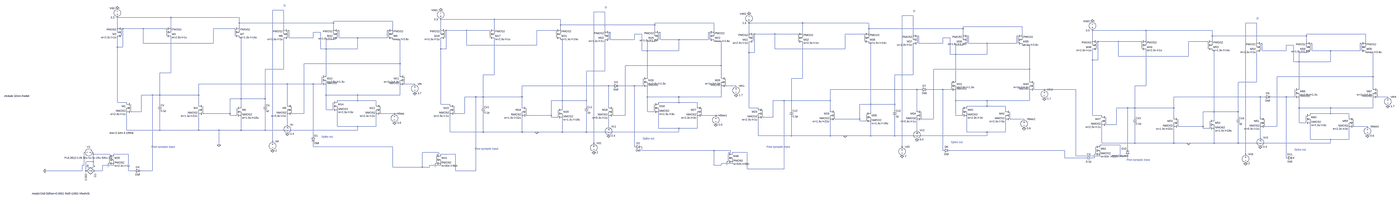
[diagram p0: schematic multineuronarray2.asc, whole sheet]
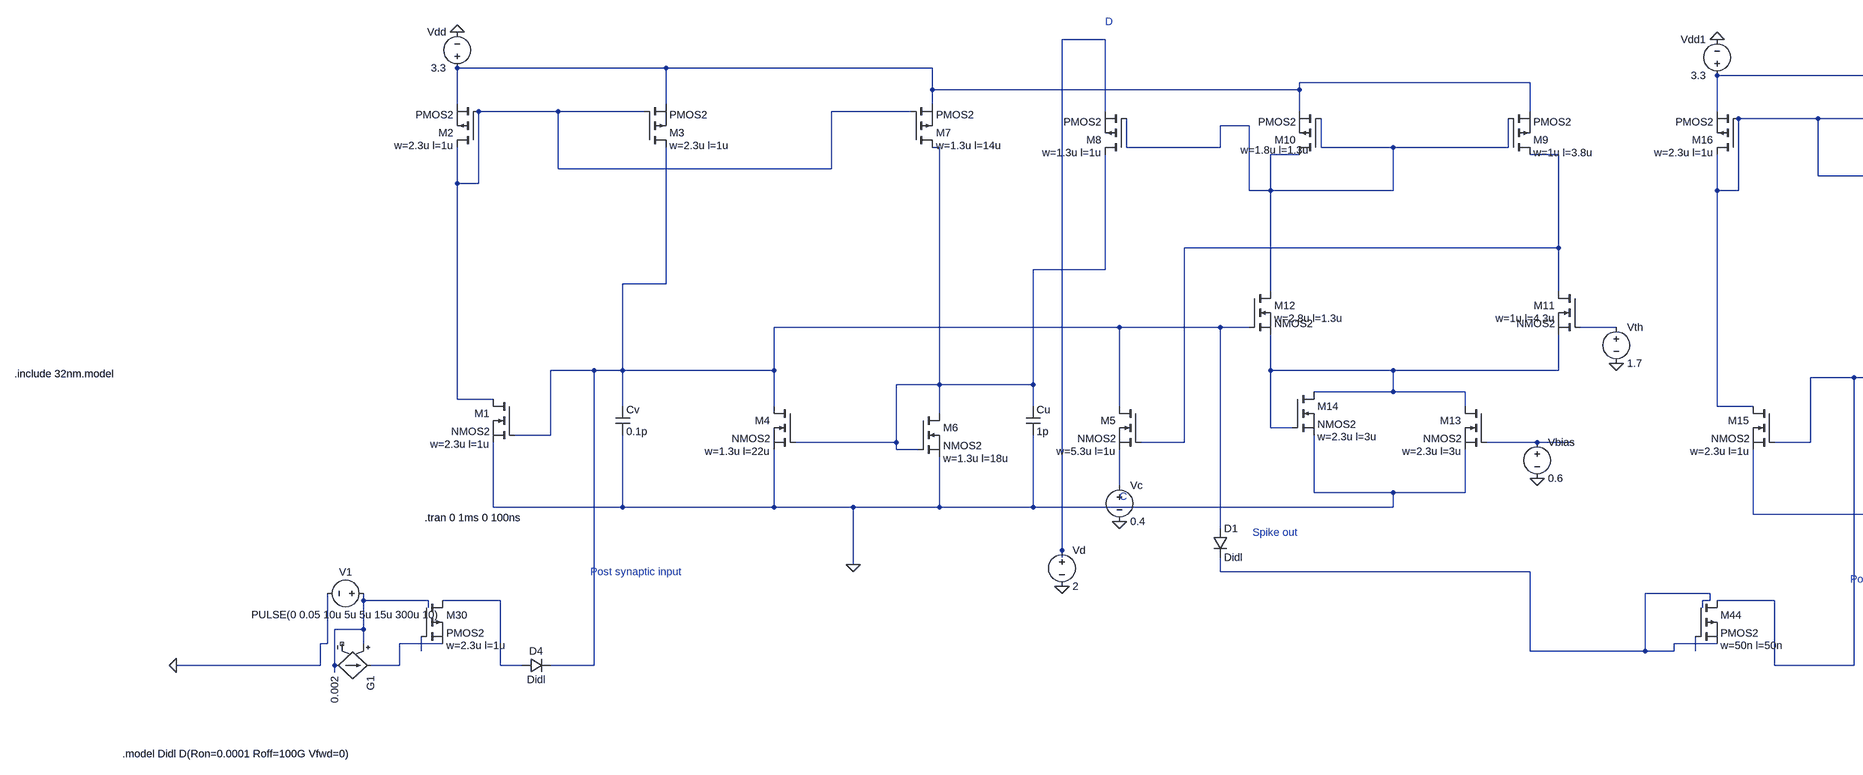
[diagram p1: schematic multineuronarray2.asc, part, row 1 of 1, column 1 of 3]
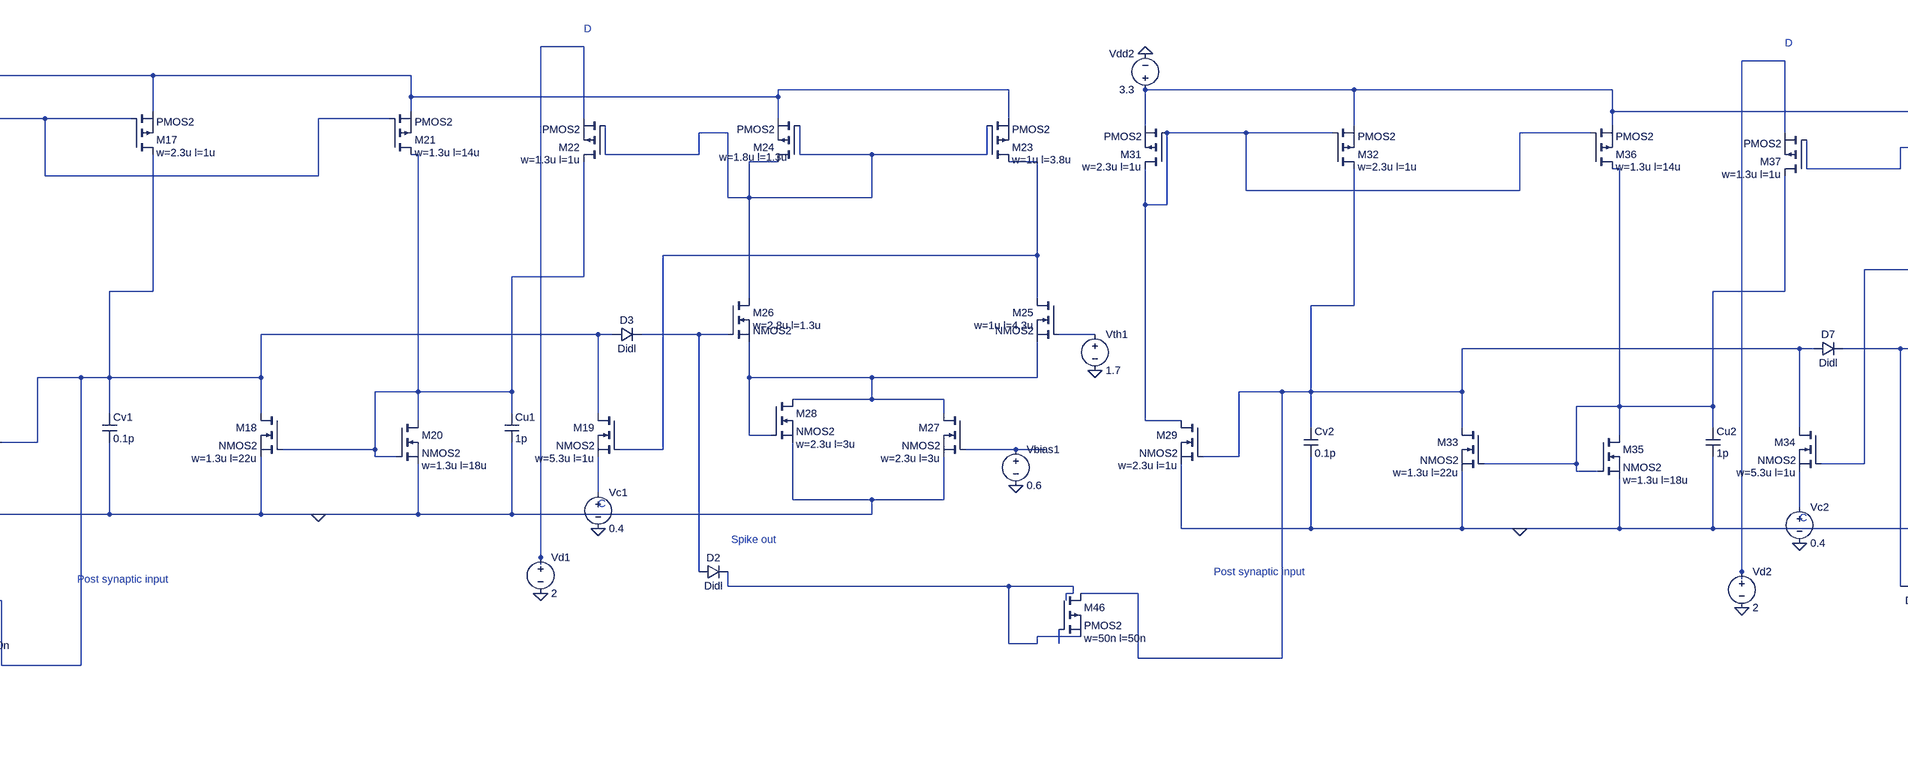
[diagram p2: schematic multineuronarray2.asc, part, row 1 of 1, column 2 of 3]
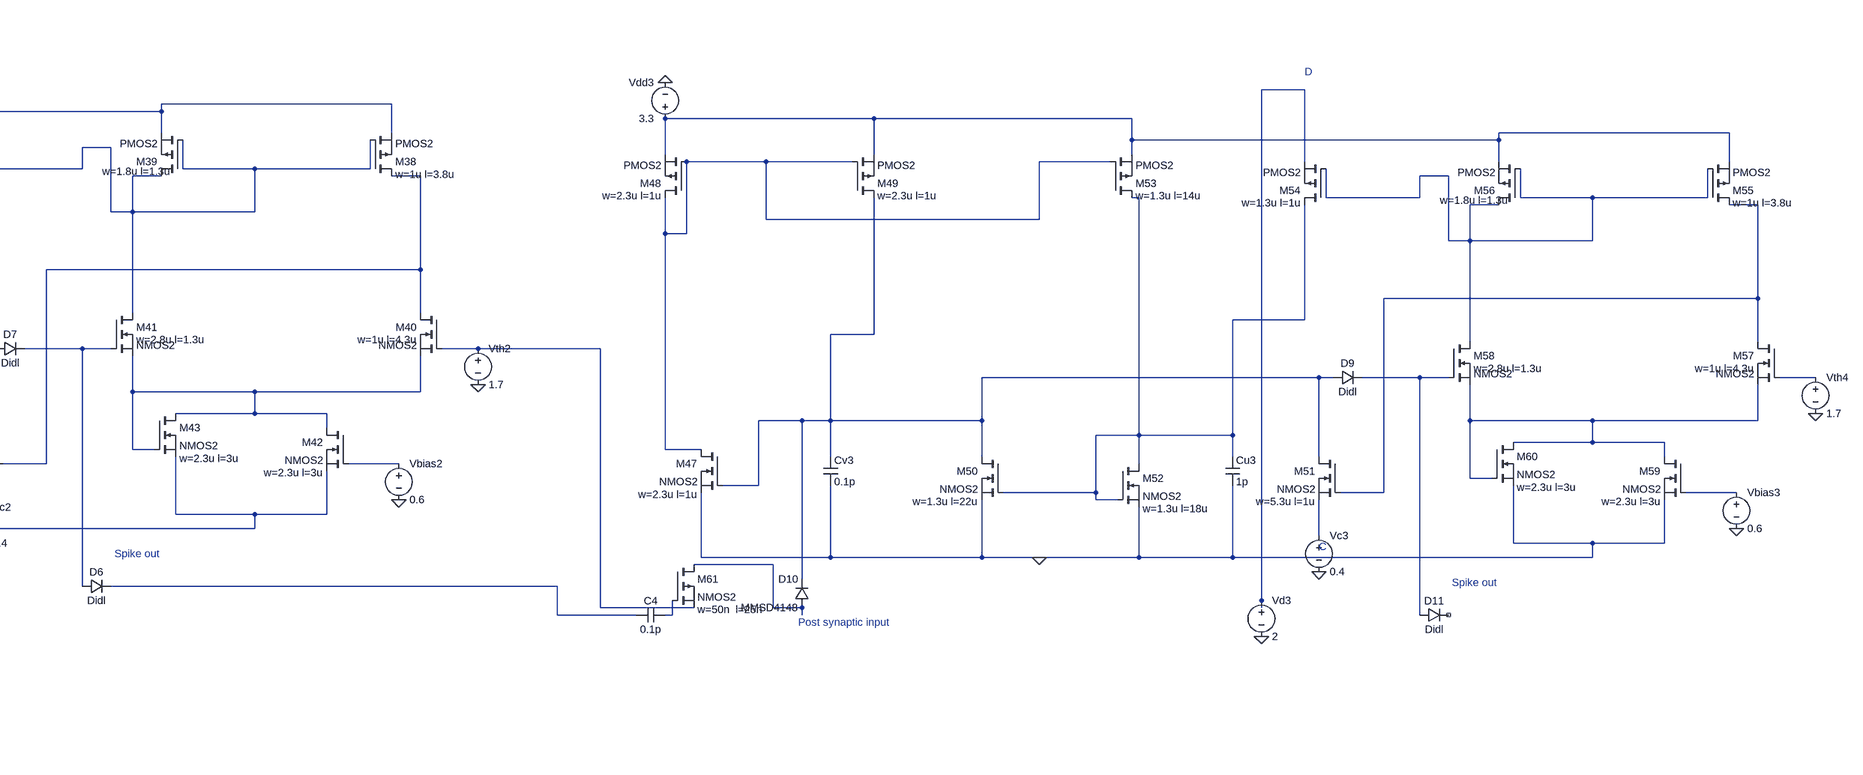
[diagram p3: schematic multineuronarray2.asc, part, row 1 of 1, column 3 of 3]
multineuronarray2.asc, the LTspice schematic file:
Version 4.1
SHEET 1 10912 1240
WIRE 1216 -736 1120 -736
WIRE 4016 -720 3920 -720
WIRE 6704 -688 6608 -688
WIRE 240 -672 -224 -672
WIRE 832 -672 240 -672
WIRE 3040 -656 2576 -656
WIRE 3632 -656 3040 -656
WIRE 2160 -640 1648 -640
WIRE 832 -624 832 -672
WIRE 1648 -624 1648 -640
WIRE 1648 -624 832 -624
WIRE 4960 -624 4448 -624
WIRE 5728 -624 5264 -624
WIRE 6320 -624 5728 -624
WIRE 9696 -624 9600 -624
WIRE 3632 -608 3632 -656
WIRE 4448 -608 4448 -624
WIRE 4448 -608 3632 -608
WIRE -224 -592 -224 -672
WIRE 240 -592 240 -672
WIRE 832 -592 832 -624
WIRE 7648 -592 7136 -592
WIRE 0 -576 -176 -576
WIRE 192 -576 0 -576
WIRE 784 -576 608 -576
WIRE 1216 -576 1216 -736
WIRE 1648 -576 1648 -624
WIRE 2160 -576 2160 -640
WIRE 2576 -576 2576 -656
WIRE 3040 -576 3040 -656
WIRE 3632 -576 3632 -608
WIRE 6320 -576 6320 -624
WIRE 7136 -576 7136 -592
WIRE 7136 -576 6320 -576
WIRE 2800 -560 2624 -560
WIRE 2992 -560 2800 -560
WIRE 3584 -560 3408 -560
WIRE 4016 -560 4016 -720
WIRE 4448 -560 4448 -608
WIRE 4960 -560 4960 -624
WIRE 8720 -560 8256 -560
WIRE 9312 -560 8720 -560
WIRE 1536 -544 1472 -544
WIRE 5264 -544 5264 -624
WIRE 5728 -544 5728 -624
WIRE 6320 -544 6320 -576
WIRE 4336 -528 4272 -528
WIRE 5488 -528 5312 -528
WIRE 5680 -528 5488 -528
WIRE 6272 -528 6096 -528
WIRE 6704 -528 6704 -688
WIRE 7136 -528 7136 -576
WIRE 7648 -528 7648 -592
WIRE 10640 -528 10128 -528
WIRE 9312 -512 9312 -560
WIRE 10128 -512 10128 -528
WIRE 10128 -512 9312 -512
WIRE 848 -496 832 -496
WIRE 1264 -496 1264 -560
WIRE 1472 -496 1472 -544
WIRE 1472 -496 1264 -496
WIRE 1696 -496 1696 -560
WIRE 1856 -496 1696 -496
WIRE 2112 -496 2112 -560
WIRE 2112 -496 1856 -496
WIRE 7024 -496 6960 -496
WIRE 1648 -480 1584 -480
WIRE 2224 -480 2160 -480
WIRE 3648 -480 3632 -480
WIRE 4064 -480 4064 -544
WIRE 4272 -480 4272 -528
WIRE 4272 -480 4064 -480
WIRE 4496 -480 4496 -544
WIRE 4656 -480 4496 -480
WIRE 4912 -480 4912 -544
WIRE 4912 -480 4656 -480
WIRE 8256 -480 8256 -560
WIRE 8720 -480 8720 -560
WIRE 9312 -480 9312 -512
WIRE 4448 -464 4384 -464
WIRE 5024 -464 4960 -464
WIRE 8480 -464 8304 -464
WIRE 8672 -464 8480 -464
WIRE 9264 -464 9088 -464
WIRE 9696 -464 9696 -624
WIRE 10128 -464 10128 -512
WIRE 10640 -464 10640 -528
WIRE 0 -448 0 -576
WIRE 608 -448 608 -576
WIRE 608 -448 0 -448
WIRE 6336 -448 6320 -448
WIRE 6752 -448 6752 -512
WIRE 6960 -448 6960 -496
WIRE 6960 -448 6752 -448
WIRE 7184 -448 7184 -512
WIRE 7344 -448 7184 -448
WIRE 7600 -448 7600 -512
WIRE 7600 -448 7344 -448
WIRE 2800 -432 2800 -560
WIRE 3408 -432 3408 -560
WIRE 3408 -432 2800 -432
WIRE 7136 -432 7072 -432
WIRE 7712 -432 7648 -432
WIRE 10016 -432 9952 -432
WIRE -224 -416 -224 -496
WIRE -176 -416 -176 -576
WIRE -176 -416 -224 -416
WIRE 1536 -400 1536 -544
WIRE 1584 -400 1584 -480
WIRE 1584 -400 1536 -400
WIRE 1856 -400 1856 -496
WIRE 1856 -400 1584 -400
WIRE 2576 -400 2576 -480
WIRE 2624 -400 2624 -560
WIRE 2624 -400 2576 -400
WIRE 5488 -400 5488 -528
WIRE 6096 -400 6096 -528
WIRE 6096 -400 5488 -400
WIRE 4336 -384 4336 -528
WIRE 4384 -384 4384 -464
WIRE 4384 -384 4336 -384
WIRE 4656 -384 4656 -480
WIRE 4656 -384 4384 -384
WIRE 9328 -384 9312 -384
WIRE 9744 -384 9744 -448
WIRE 9952 -384 9952 -432
WIRE 9952 -384 9744 -384
WIRE 10176 -384 10176 -448
WIRE 10336 -384 10176 -384
WIRE 10592 -384 10592 -448
WIRE 10592 -384 10336 -384
WIRE 5264 -368 5264 -448
WIRE 5312 -368 5312 -528
WIRE 5312 -368 5264 -368
WIRE 10128 -368 10064 -368
WIRE 10704 -368 10640 -368
WIRE 7024 -352 7024 -496
WIRE 7072 -352 7072 -432
WIRE 7072 -352 7024 -352
WIRE 7344 -352 7344 -448
WIRE 7344 -352 7072 -352
WIRE 8480 -336 8480 -464
WIRE 9088 -336 9088 -464
WIRE 9088 -336 8480 -336
WIRE 8256 -304 8256 -384
WIRE 8304 -304 8304 -464
WIRE 8304 -304 8256 -304
WIRE 10016 -288 10016 -432
WIRE 10064 -288 10064 -368
WIRE 10064 -288 10016 -288
WIRE 10336 -288 10336 -384
WIRE 10336 -288 10064 -288
WIRE 2224 -272 2224 -480
WIRE 2224 -272 1392 -272
WIRE 5024 -256 5024 -464
WIRE 5024 -256 4192 -256
WIRE 1216 -224 1216 -480
WIRE 1216 -224 1056 -224
WIRE 7712 -224 7712 -432
WIRE 7712 -224 6880 -224
WIRE 4016 -208 4016 -464
WIRE 4016 -208 3856 -208
WIRE 240 -192 240 -496
WIRE 240 -192 144 -192
WIRE 1584 -176 1584 -400
WIRE 2224 -176 2224 -272
WIRE 3040 -176 3040 -480
WIRE 3040 -176 2944 -176
WIRE 6704 -176 6704 -432
WIRE 6704 -176 6544 -176
WIRE 4384 -160 4384 -384
WIRE 5024 -160 5024 -256
WIRE 10704 -160 10704 -368
WIRE 10704 -160 9872 -160
WIRE 5728 -144 5728 -448
WIRE 5728 -144 5632 -144
WIRE 7072 -128 7072 -352
WIRE 7712 -128 7712 -224
WIRE 9696 -112 9696 -368
WIRE 9696 -112 9536 -112
WIRE 1248 -96 480 -96
WIRE 1472 -96 1248 -96
WIRE 1536 -96 1472 -96
WIRE 2352 -96 2272 -96
WIRE 4048 -80 3280 -80
WIRE 4080 -80 4048 -80
WIRE 4272 -80 4144 -80
WIRE 4336 -80 4272 -80
WIRE 5152 -80 5072 -80
WIRE 8720 -80 8720 -384
WIRE 8720 -80 8624 -80
WIRE 10064 -64 10064 -288
WIRE 10704 -64 10704 -160
WIRE 6736 -48 5968 -48
WIRE 6768 -48 6736 -48
WIRE 6960 -48 6832 -48
WIRE 7024 -48 6960 -48
WIRE 7840 -48 7760 -48
WIRE 8112 -48 7840 -48
WIRE 80 0 -16 0
WIRE 144 0 144 -192
WIRE 144 0 80 0
WIRE 480 0 480 -96
WIRE 480 0 144 0
WIRE 1584 0 1584 -80
WIRE 1856 0 1584 0
WIRE 2224 0 2224 -80
WIRE 2224 0 1856 0
WIRE 2880 16 2784 16
WIRE 2944 16 2944 -176
WIRE 2944 16 2880 16
WIRE 3280 16 3280 -80
WIRE 3280 16 2944 16
WIRE 4384 16 4384 -64
WIRE 4656 16 4384 16
WIRE 5024 16 5024 -64
WIRE 5024 16 4656 16
WIRE 9728 16 8960 16
WIRE 9760 16 9728 16
WIRE 9952 16 9824 16
WIRE 10016 16 9952 16
WIRE 10832 16 10752 16
WIRE 848 32 848 -496
WIRE 848 32 752 32
WIRE 1056 32 1056 -224
WIRE 1056 32 848 32
WIRE 1856 48 1856 0
WIRE 1856 48 1680 48
WIRE 2016 48 1856 48
WIRE 3648 48 3648 -480
WIRE 3648 48 3552 48
WIRE 3856 48 3856 -208
WIRE 3856 48 3648 48
WIRE 5568 48 5472 48
WIRE 5632 48 5632 -144
WIRE 5632 48 5568 48
WIRE 5968 48 5968 -48
WIRE 5968 48 5632 48
WIRE 7072 48 7072 -32
WIRE 7344 48 7072 48
WIRE 7712 48 7712 -32
WIRE 7712 48 7344 48
WIRE -224 64 -224 -416
WIRE -144 64 -224 64
WIRE 4656 64 4656 16
WIRE 4656 64 4480 64
WIRE 4816 64 4656 64
WIRE 144 80 144 0
WIRE 480 80 480 0
WIRE 1056 80 1056 32
WIRE 1248 80 1248 -96
WIRE 2016 80 2016 48
WIRE 2576 80 2576 -400
WIRE 2656 80 2576 80
WIRE 6336 80 6336 -448
WIRE 6336 80 6240 80
WIRE 6544 80 6544 -176
WIRE 6544 80 6336 80
WIRE 848 96 848 32
WIRE 2944 96 2944 16
WIRE 3280 96 3280 16
WIRE 3856 96 3856 48
WIRE 4048 96 4048 -80
WIRE 4816 96 4816 64
WIRE 7344 96 7344 48
WIRE 7344 96 7168 96
WIRE 7504 96 7344 96
WIRE 3648 112 3648 48
WIRE 5264 112 5264 -368
WIRE 5344 112 5264 112
WIRE 8560 112 8464 112
WIRE 8624 112 8624 -80
WIRE 8624 112 8560 112
WIRE 8960 112 8960 16
WIRE 8960 112 8624 112
WIRE 10064 112 10064 32
WIRE 10336 112 10064 112
WIRE 10704 112 10704 32
WIRE 10704 112 10336 112
WIRE 1584 128 1584 0
WIRE 1632 128 1584 128
WIRE 5632 128 5632 48
WIRE 5968 128 5968 48
WIRE 6544 128 6544 80
WIRE 6736 128 6736 -48
WIRE 7504 128 7504 96
WIRE -16 144 -16 0
WIRE -16 144 -96 144
WIRE 4384 144 4384 16
WIRE 4432 144 4384 144
WIRE 6336 144 6336 80
WIRE 9328 144 9328 -384
WIRE 9328 144 9232 144
WIRE 9536 144 9536 -112
WIRE 9536 144 9328 144
WIRE 752 160 752 32
WIRE 752 160 528 160
WIRE 1392 160 1392 -272
WIRE 1392 160 1296 160
WIRE 2176 160 2064 160
WIRE 2256 160 2176 160
WIRE 2784 160 2784 16
WIRE 2784 160 2704 160
WIRE 10336 160 10336 112
WIRE 10336 160 10160 160
WIRE 10496 160 10336 160
WIRE 752 176 752 160
WIRE 800 176 752 176
WIRE 3552 176 3552 48
WIRE 3552 176 3328 176
WIRE 4192 176 4192 -256
WIRE 4192 176 4096 176
WIRE 4976 176 4864 176
WIRE 5040 176 4976 176
WIRE 7072 176 7072 48
WIRE 7120 176 7072 176
WIRE 8256 176 8256 -304
WIRE 8336 176 8256 176
WIRE 3552 192 3552 176
WIRE 3600 192 3552 192
WIRE 5472 192 5472 48
WIRE 5472 192 5392 192
WIRE 8624 192 8624 112
WIRE 8960 192 8960 112
WIRE 9536 192 9536 144
WIRE 9728 192 9728 16
WIRE 10496 192 10496 160
WIRE 6240 208 6240 80
WIRE 6240 208 6016 208
WIRE 6880 208 6880 -224
WIRE 6880 208 6784 208
WIRE 7664 208 7552 208
WIRE 9328 208 9328 144
WIRE 6240 224 6240 208
WIRE 6288 224 6240 224
WIRE 10064 240 10064 112
WIRE 10112 240 10064 240
WIRE 1248 256 1248 176
WIRE 8464 256 8464 112
WIRE 8464 256 8384 256
WIRE 1680 272 1680 144
WIRE 1856 272 1680 272
WIRE 2016 272 2016 176
WIRE 2016 272 1856 272
WIRE 4048 272 4048 192
WIRE 9232 272 9232 144
WIRE 9232 272 9008 272
WIRE 9872 272 9872 -160
WIRE 9872 272 9776 272
WIRE 10656 272 10544 272
WIRE 4480 288 4480 160
WIRE 4656 288 4480 288
WIRE 4816 288 4816 192
WIRE 4816 288 4656 288
WIRE 9232 288 9232 272
WIRE 9280 288 9232 288
WIRE -144 304 -144 160
WIRE 144 304 144 144
WIRE 144 304 -144 304
WIRE 480 304 480 176
WIRE 480 304 144 304
WIRE 656 304 480 304
WIRE 848 304 848 192
WIRE 848 304 656 304
WIRE 1056 304 1056 144
WIRE 1056 304 848 304
WIRE 1856 304 1856 272
WIRE 1856 304 1056 304
WIRE 6736 304 6736 224
WIRE 2656 320 2656 176
WIRE 2944 320 2944 160
WIRE 2944 320 2656 320
WIRE 3280 320 3280 192
WIRE 3280 320 2944 320
WIRE 3408 320 3280 320
WIRE 3648 320 3648 208
WIRE 3648 320 3408 320
WIRE 3856 320 3856 160
WIRE 3856 320 3648 320
WIRE 4656 320 4656 288
WIRE 4656 320 3856 320
WIRE 7168 320 7168 192
WIRE 7344 320 7168 320
WIRE 7504 320 7504 224
WIRE 7504 320 7344 320
WIRE 1472 352 1472 -96
WIRE 5344 352 5344 208
WIRE 5632 352 5632 192
WIRE 5632 352 5344 352
WIRE 5968 352 5968 224
WIRE 5968 352 5632 352
WIRE 6096 352 5968 352
WIRE 6336 352 6336 240
WIRE 6336 352 6096 352
WIRE 6544 352 6544 192
WIRE 6544 352 6336 352
WIRE 7344 352 7344 320
WIRE 7344 352 6544 352
WIRE 9728 368 9728 288
WIRE 10160 384 10160 256
WIRE 10336 384 10160 384
WIRE 10496 384 10496 288
WIRE 10496 384 10336 384
WIRE 1120 400 1120 -736
WIRE 1120 416 1120 400
WIRE 3920 416 3920 -720
WIRE 8336 416 8336 272
WIRE 8624 416 8624 256
WIRE 8624 416 8336 416
WIRE 8960 416 8960 288
WIRE 8960 416 8624 416
WIRE 9088 416 8960 416
WIRE 9328 416 9328 304
WIRE 9328 416 9088 416
WIRE 9536 416 9536 256
WIRE 9536 416 9328 416
WIRE 10336 416 10336 384
WIRE 10336 416 9536 416
WIRE 656 432 656 304
WIRE 3920 432 3920 416
WIRE 8496 432 8320 432
WIRE 1472 448 1472 416
WIRE 2160 448 1472 448
WIRE 4272 448 4272 -80
WIRE 6608 448 6608 -688
WIRE 6608 464 6608 448
WIRE 8560 464 8560 112
WIRE 4336 480 4336 448
WIRE 4960 480 4336 480
WIRE 5104 480 4960 480
WIRE 6960 480 6960 -48
WIRE 8016 480 7024 480
WIRE 2560 496 2416 496
WIRE 5104 496 5104 480
WIRE 5104 496 5088 496
WIRE 5248 496 5120 496
WIRE -432 512 -432 496
WIRE -288 512 -432 512
WIRE -128 512 -256 512
WIRE 2560 512 2560 496
WIRE 2560 512 2544 512
WIRE 2704 512 2576 512
WIRE 5088 512 5088 496
WIRE 9600 512 9600 -624
WIRE -288 528 -288 512
WIRE 2544 528 2544 512
WIRE 8112 528 8112 -48
WIRE 8320 528 8112 528
WIRE 8496 528 8496 432
WIRE 8560 528 8496 528
WIRE 9600 528 9600 512
WIRE 8016 544 8016 480
WIRE 8192 544 8016 544
WIRE 8272 544 8272 512
WIRE 8272 544 8256 544
WIRE 8560 544 8560 528
WIRE 9952 544 9952 16
WIRE -432 576 -432 512
WIRE -432 576 -496 576
WIRE 5120 592 5024 592
WIRE -512 608 -512 496
WIRE -512 608 -528 608
WIRE -432 608 -432 576
WIRE -256 608 -352 608
WIRE 2576 608 2480 608
WIRE 4960 608 4960 480
WIRE 5024 608 5024 592
WIRE 5024 608 4960 608
WIRE 5072 608 5072 576
WIRE -304 624 -304 592
WIRE 2160 624 2160 448
WIRE 2416 624 2416 496
WIRE 2416 624 2160 624
WIRE 2480 624 2480 608
WIRE 2480 624 2416 624
WIRE 2528 624 2528 592
WIRE 5248 640 5248 496
WIRE 5568 640 5568 48
WIRE 5568 640 5248 640
WIRE -528 656 -528 608
WIRE -528 656 -848 656
WIRE -496 656 -496 576
WIRE -352 656 -352 608
WIRE -352 656 -416 656
WIRE -128 656 -128 512
WIRE -80 656 -128 656
WIRE 80 656 80 0
WIRE 80 656 -16 656
WIRE 2704 656 2704 512
WIRE 2880 656 2880 16
WIRE 2880 656 2704 656
WIRE -496 672 -496 656
FLAG -224 -752 0
FLAG 2176 240 0
FLAG 2352 -16 0
FLAG 1120 480 0
FLAG 1248 336 0
FLAG 656 432 0
FLAG -848 656 0
FLAG 2576 -736 0
FLAG 4976 256 0
FLAG 5152 0 0
FLAG 3920 496 0
FLAG 4048 352 0
FLAG 3408 320 0
FLAG 5264 -704 0
FLAG 7664 288 0
FLAG 7840 32 0
FLAG 6608 528 0
FLAG 6736 384 0
FLAG 6096 352 0
FLAG 8256 -640 0
FLAG 10656 352 0
FLAG 10832 96 0
FLAG 9600 592 0
FLAG 9728 448 0
FLAG 9088 416 0
DATAFLAG 848 -144 ""
DATAFLAG 3648 -128 ""
DATAFLAG 6336 -96 ""
DATAFLAG 9328 -32 ""
SYMBOL nmos -96 64 M0
WINDOW 123 56 100 Left 2
SYMATTR Value2 w=2.3u l=1u
SYMATTR InstName M1
SYMATTR Value NMOS2
SYMBOL pmos -176 -496 R180
WINDOW 123 56 4 Left 2
SYMATTR Value2 w=2.3u l=1u
SYMATTR InstName M2
SYMATTR Value PMOS2
SYMBOL pmos 192 -496 M180
WINDOW 123 56 4 Left 2
SYMATTR Value2 w=2.3u l=1u
SYMATTR InstName M3
SYMATTR Value PMOS2
SYMBOL nmos 528 80 M0
WINDOW 123 56 100 Left 2
SYMATTR Value2 w=1.3u l=22u
SYMATTR InstName M4
SYMATTR Value NMOS2
SYMBOL nmos 1296 80 M0
WINDOW 123 56 100 Left 2
SYMATTR Value2 w=5.3u l=1u
SYMATTR InstName M5
SYMATTR Value NMOS2
SYMBOL nmos 800 96 R0
WINDOW 123 56 100 Left 2
SYMATTR Value2 w=1.3u l=18u
SYMATTR InstName M6
SYMATTR Value NMOS2
SYMBOL pmos 784 -496 M180
WINDOW 123 56 4 Left 2
SYMATTR Value2 w=1.3u l=14u
SYMATTR InstName M7
SYMATTR Value PMOS2
SYMBOL pmos 1264 -480 R180
WINDOW 123 56 4 Left 2
SYMATTR Value2 w=1.3u l=1u
SYMATTR InstName M8
SYMATTR Value PMOS2
SYMBOL pmos 2112 -480 M180
WINDOW 123 56 4 Left 2
SYMATTR Value2 w=1u l=3.8u
SYMATTR InstName M9
SYMATTR Value PMOS2
SYMBOL pmos 1696 -480 R180
WINDOW 123 27 10 Left 2
SYMATTR Value2 w=1.8u l=1.3u
SYMATTR InstName M10
SYMATTR Value PMOS2
SYMBOL nmos 2272 -176 M0
WINDOW 123 56 60 Left 2
SYMATTR Value2 w=1u l=4.3u
SYMATTR InstName M11
SYMATTR Value NMOS2
SYMBOL nmos 1536 -176 R0
WINDOW 123 56 60 Left 2
SYMATTR Value2 w=2.8u l=1.3u
SYMATTR InstName M12
SYMATTR Value NMOS2
SYMBOL nmos 2064 80 M0
WINDOW 123 56 100 Left 2
SYMATTR Value2 w=2.3u l=3u
SYMATTR InstName M13
SYMATTR Value NMOS2
SYMBOL nmos 1632 48 R0
WINDOW 123 56 100 Left 2
SYMATTR Value2 w=2.3u l=3u
SYMATTR InstName M14
SYMATTR Value NMOS2
SYMBOL cap 1040 80 R0
SYMATTR InstName Cu
SYMATTR Value 1p
SYMBOL cap 128 80 R0
SYMATTR InstName Cv
SYMATTR Value 0.1p
SYMBOL voltage -224 -656 R180
WINDOW 0 24 96 Left 2
WINDOW 3 24 16 Left 2
WINDOW 123 0 0 Left 0
WINDOW 39 0 0 Left 0
SYMATTR InstName Vdd
SYMATTR Value 3.3
SYMBOL voltage 2352 -112 R0
WINDOW 123 0 0 Left 0
WINDOW 39 0 0 Left 0
SYMATTR InstName Vth
SYMATTR Value 1.7
SYMBOL voltage 2176 144 R0
WINDOW 123 0 0 Left 0
WINDOW 39 0 0 Left 0
SYMATTR InstName Vbias
SYMATTR Value 0.6
SYMBOL voltage 1120 384 R0
SYMATTR InstName Vd
SYMATTR Value 2
SYMBOL voltage 1248 240 R0
SYMATTR InstName Vc
SYMATTR Value 0.4
SYMBOL nmos 2704 80 M0
WINDOW 123 56 100 Left 2
SYMATTR Value2 w=2.3u l=1u
SYMATTR InstName M15
SYMATTR Value NMOS2
SYMBOL pmos 2624 -480 R180
WINDOW 123 56 4 Left 2
SYMATTR Value2 w=2.3u l=1u
SYMATTR InstName M16
SYMATTR Value PMOS2
SYMBOL pmos 2992 -480 M180
WINDOW 123 56 4 Left 2
SYMATTR Value2 w=2.3u l=1u
SYMATTR InstName M17
SYMATTR Value PMOS2
SYMBOL nmos 3328 96 M0
WINDOW 123 56 100 Left 2
SYMATTR Value2 w=1.3u l=22u
SYMATTR InstName M18
SYMATTR Value NMOS2
SYMBOL nmos 4096 96 M0
WINDOW 123 56 100 Left 2
SYMATTR Value2 w=5.3u l=1u
SYMATTR InstName M19
SYMATTR Value NMOS2
SYMBOL nmos 3600 112 R0
WINDOW 123 56 100 Left 2
SYMATTR Value2 w=1.3u l=18u
SYMATTR InstName M20
SYMATTR Value NMOS2
SYMBOL pmos 3584 -480 M180
WINDOW 123 56 4 Left 2
SYMATTR Value2 w=1.3u l=14u
SYMATTR InstName M21
SYMATTR Value PMOS2
SYMBOL pmos 4064 -464 R180
WINDOW 123 56 4 Left 2
SYMATTR Value2 w=1.3u l=1u
SYMATTR InstName M22
SYMATTR Value PMOS2
SYMBOL pmos 4912 -464 M180
WINDOW 123 56 4 Left 2
SYMATTR Value2 w=1u l=3.8u
SYMATTR InstName M23
SYMATTR Value PMOS2
SYMBOL pmos 4496 -464 R180
WINDOW 123 27 10 Left 2
SYMATTR Value2 w=1.8u l=1.3u
SYMATTR InstName M24
SYMATTR Value PMOS2
SYMBOL nmos 5072 -160 M0
WINDOW 123 56 60 Left 2
SYMATTR Value2 w=1u l=4.3u
SYMATTR InstName M25
SYMATTR Value NMOS2
SYMBOL nmos 4336 -160 R0
WINDOW 123 56 60 Left 2
SYMATTR Value2 w=2.8u l=1.3u
SYMATTR InstName M26
SYMATTR Value NMOS2
SYMBOL nmos 4864 96 M0
WINDOW 123 56 100 Left 2
SYMATTR Value2 w=2.3u l=3u
SYMATTR InstName M27
SYMATTR Value NMOS2
SYMBOL nmos 4432 64 R0
WINDOW 123 56 100 Left 2
SYMATTR Value2 w=2.3u l=3u
SYMATTR InstName M28
SYMATTR Value NMOS2
SYMBOL cap 3840 96 R0
SYMATTR InstName Cu1
SYMATTR Value 1p
SYMBOL cap 2928 96 R0
SYMATTR InstName Cv1
SYMATTR Value 0.1p
SYMBOL voltage 2576 -640 R180
WINDOW 0 24 96 Left 2
WINDOW 3 24 16 Left 2
WINDOW 123 0 0 Left 0
WINDOW 39 0 0 Left 0
SYMATTR InstName Vdd1
SYMATTR Value 3.3
SYMBOL voltage 5152 -96 R0
WINDOW 123 0 0 Left 0
WINDOW 39 0 0 Left 0
SYMATTR InstName Vth1
SYMATTR Value 1.7
SYMBOL voltage 4976 160 R0
WINDOW 123 0 0 Left 0
WINDOW 39 0 0 Left 0
SYMATTR InstName Vbias1
SYMATTR Value 0.6
SYMBOL voltage 3920 400 R0
SYMATTR InstName Vd1
SYMATTR Value 2
SYMBOL voltage 4048 256 R0
SYMATTR InstName Vc1
SYMATTR Value 0.4
SYMBOL diode 4080 -64 R270
WINDOW 0 32 32 VTop 2
WINDOW 3 0 32 VBottom 2
SYMATTR InstName D3
SYMATTR Value Didl
SYMBOL g -400 656 R90
SYMATTR InstName G1
SYMATTR Value 0.002
SYMBOL voltage -416 496 R90
WINDOW 0 -32 56 VBottom 2
WINDOW 3 32 56 VTop 2
WINDOW 123 0 0 Left 0
WINDOW 39 0 0 Left 0
SYMATTR InstName V1
SYMATTR Value PULSE(0 0.05 10u 5u 5u 15u 300u 10)
SYMBOL diode -80 672 R270
WINDOW 0 32 32 VTop 2
WINDOW 3 0 32 VBottom 2
SYMATTR InstName D4
SYMATTR Value Didl
SYMBOL pmos -304 512 R0
WINDOW 123 56 100 Left 2
SYMATTR Value2 w=2.3u l=1u
SYMATTR InstName M30
SYMATTR Value PMOS2
SYMBOL nmos 5392 112 M0
WINDOW 123 56 100 Left 2
SYMATTR Value2 w=2.3u l=1u
SYMATTR InstName M29
SYMATTR Value NMOS2
SYMBOL pmos 5312 -448 R180
WINDOW 123 56 4 Left 2
SYMATTR Value2 w=2.3u l=1u
SYMATTR InstName M31
SYMATTR Value PMOS2
SYMBOL pmos 5680 -448 M180
WINDOW 123 56 4 Left 2
SYMATTR Value2 w=2.3u l=1u
SYMATTR InstName M32
SYMATTR Value PMOS2
SYMBOL nmos 6016 128 M0
WINDOW 123 56 100 Left 2
SYMATTR Value2 w=1.3u l=22u
SYMATTR InstName M33
SYMATTR Value NMOS2
SYMBOL nmos 6784 128 M0
WINDOW 123 56 100 Left 2
SYMATTR Value2 w=5.3u l=1u
SYMATTR InstName M34
SYMATTR Value NMOS2
SYMBOL nmos 6288 144 R0
WINDOW 123 56 100 Left 2
SYMATTR Value2 w=1.3u l=18u
SYMATTR InstName M35
SYMATTR Value NMOS2
SYMBOL pmos 6272 -448 M180
WINDOW 123 56 4 Left 2
SYMATTR Value2 w=1.3u l=14u
SYMATTR InstName M36
SYMATTR Value PMOS2
SYMBOL pmos 6752 -432 R180
WINDOW 123 56 4 Left 2
SYMATTR Value2 w=1.3u l=1u
SYMATTR InstName M37
SYMATTR Value PMOS2
SYMBOL pmos 7600 -432 M180
WINDOW 123 56 4 Left 2
SYMATTR Value2 w=1u l=3.8u
SYMATTR InstName M38
SYMATTR Value PMOS2
SYMBOL pmos 7184 -432 R180
WINDOW 123 27 10 Left 2
SYMATTR Value2 w=1.8u l=1.3u
SYMATTR InstName M39
SYMATTR Value PMOS2
SYMBOL nmos 7760 -128 M0
WINDOW 123 56 60 Left 2
SYMATTR Value2 w=1u l=4.3u
SYMATTR InstName M40
SYMATTR Value NMOS2
SYMBOL nmos 7024 -128 R0
WINDOW 123 56 60 Left 2
SYMATTR Value2 w=2.8u l=1.3u
SYMATTR InstName M41
SYMATTR Value NMOS2
SYMBOL nmos 7552 128 M0
WINDOW 123 56 100 Left 2
SYMATTR Value2 w=2.3u l=3u
SYMATTR InstName M42
SYMATTR Value NMOS2
SYMBOL nmos 7120 96 R0
WINDOW 123 56 100 Left 2
SYMATTR Value2 w=2.3u l=3u
SYMATTR InstName M43
SYMATTR Value NMOS2
SYMBOL cap 6528 128 R0
SYMATTR InstName Cu2
SYMATTR Value 1p
SYMBOL cap 5616 128 R0
SYMATTR InstName Cv2
SYMATTR Value 0.1p
SYMBOL voltage 5264 -608 R180
WINDOW 0 24 96 Left 2
WINDOW 3 24 16 Left 2
WINDOW 123 0 0 Left 0
WINDOW 39 0 0 Left 0
SYMATTR InstName Vdd2
SYMATTR Value 3.3
SYMBOL voltage 7840 -64 R0
WINDOW 123 0 0 Left 0
WINDOW 39 0 0 Left 0
SYMATTR InstName Vth2
SYMATTR Value 1.7
SYMBOL voltage 7664 192 R0
WINDOW 123 0 0 Left 0
WINDOW 39 0 0 Left 0
SYMATTR InstName Vbias2
SYMATTR Value 0.6
SYMBOL voltage 6608 432 R0
SYMATTR InstName Vd2
SYMATTR Value 2
SYMBOL voltage 6736 288 R0
SYMATTR InstName Vc2
SYMATTR Value 0.4
SYMBOL diode 6768 -32 R270
WINDOW 0 32 32 VTop 2
WINDOW 3 0 32 VBottom 2
SYMATTR InstName D7
SYMATTR Value Didl
SYMBOL diode 4272 464 R270
WINDOW 0 32 32 VTop 2
WINDOW 3 0 32 VBottom 2
SYMATTR InstName D2
SYMATTR Value Didl
SYMBOL diode 6960 496 R270
WINDOW 0 32 32 VTop 2
WINDOW 3 0 32 VBottom 2
SYMATTR InstName D6
SYMATTR Value Didl
SYMBOL nmos 8384 176 M0
WINDOW 123 56 100 Left 2
SYMATTR Value2 w=2.3u l=1u
SYMATTR InstName M47
SYMATTR Value NMOS2
SYMBOL pmos 8304 -384 R180
WINDOW 123 56 4 Left 2
SYMATTR Value2 w=2.3u l=1u
SYMATTR InstName M48
SYMATTR Value PMOS2
SYMBOL pmos 8672 -384 M180
WINDOW 123 56 4 Left 2
SYMATTR Value2 w=2.3u l=1u
SYMATTR InstName M49
SYMATTR Value PMOS2
SYMBOL nmos 9008 192 M0
WINDOW 123 56 100 Left 2
SYMATTR Value2 w=1.3u l=22u
SYMATTR InstName M50
SYMATTR Value NMOS2
SYMBOL nmos 9776 192 M0
WINDOW 123 56 100 Left 2
SYMATTR Value2 w=5.3u l=1u
SYMATTR InstName M51
SYMATTR Value NMOS2
SYMBOL nmos 9280 208 R0
WINDOW 123 56 100 Left 2
SYMATTR Value2 w=1.3u l=18u
SYMATTR InstName M52
SYMATTR Value NMOS2
SYMBOL pmos 9264 -384 M180
WINDOW 123 56 4 Left 2
SYMATTR Value2 w=1.3u l=14u
SYMATTR InstName M53
SYMATTR Value PMOS2
SYMBOL pmos 9744 -368 R180
WINDOW 123 56 4 Left 2
SYMATTR Value2 w=1.3u l=1u
SYMATTR InstName M54
SYMATTR Value PMOS2
SYMBOL pmos 10592 -368 M180
WINDOW 123 56 4 Left 2
SYMATTR Value2 w=1u l=3.8u
SYMATTR InstName M55
SYMATTR Value PMOS2
SYMBOL pmos 10176 -368 R180
WINDOW 123 27 10 Left 2
SYMATTR Value2 w=1.8u l=1.3u
SYMATTR InstName M56
SYMATTR Value PMOS2
SYMBOL nmos 10752 -64 M0
WINDOW 123 56 60 Left 2
SYMATTR Value2 w=1u l=4.3u
SYMATTR InstName M57
SYMATTR Value NMOS2
SYMBOL nmos 10016 -64 R0
WINDOW 123 56 60 Left 2
SYMATTR Value2 w=2.8u l=1.3u
SYMATTR InstName M58
SYMATTR Value NMOS2
SYMBOL nmos 10544 192 M0
WINDOW 123 56 100 Left 2
SYMATTR Value2 w=2.3u l=3u
SYMATTR InstName M59
SYMATTR Value NMOS2
SYMBOL nmos 10112 160 R0
WINDOW 123 56 100 Left 2
SYMATTR Value2 w=2.3u l=3u
SYMATTR InstName M60
SYMATTR Value NMOS2
SYMBOL cap 9520 192 R0
SYMATTR InstName Cu3
SYMATTR Value 1p
SYMBOL cap 8608 192 R0
SYMATTR InstName Cv3
SYMATTR Value 0.1p
SYMBOL voltage 8256 -544 R180
WINDOW 0 24 96 Left 2
WINDOW 3 24 16 Left 2
WINDOW 123 0 0 Left 0
WINDOW 39 0 0 Left 0
SYMATTR InstName Vdd3
SYMATTR Value 3.3
SYMBOL voltage 10832 0 R0
WINDOW 123 0 0 Left 0
WINDOW 39 0 0 Left 0
SYMATTR InstName Vth4
SYMATTR Value 1.7
SYMBOL voltage 10656 256 R0
WINDOW 123 0 0 Left 0
WINDOW 39 0 0 Left 0
SYMATTR InstName Vbias3
SYMATTR Value 0.6
SYMBOL voltage 9600 496 R0
SYMATTR InstName Vd3
SYMATTR Value 2
SYMBOL voltage 9728 352 R0
SYMATTR InstName Vc3
SYMATTR Value 0.4
SYMBOL diode 9760 32 R270
WINDOW 0 32 32 VTop 2
WINDOW 3 0 32 VBottom 2
SYMATTR InstName D9
SYMATTR Value Didl
SYMBOL diode 8576 528 R180
WINDOW 0 24 64 Left 2
WINDOW 3 24 0 Left 2
SYMATTR InstName D10
SYMATTR Value MMSD4148
SYMBOL diode 9952 560 R270
WINDOW 0 32 32 VTop 2
WINDOW 3 0 32 VBottom 2
SYMATTR InstName D11
SYMATTR Value Didl
SYMBOL pmos 8272 432 R0
WINDOW 123 56 100 Left 2
SYMATTR InstName M61
SYMATTR Value NMOS2
SYMATTR Value2 w=50n  l=25n
SYMBOL cap 8256 528 R90
WINDOW 0 0 32 VBottom 2
WINDOW 3 32 32 VTop 2
SYMATTR InstName C4
SYMATTR Value 0.1p
SYMBOL pmos 2528 512 R0
WINDOW 123 56 100 Left 2
SYMATTR Value2 w=50n l=50n
SYMATTR InstName M44
SYMATTR Value PMOS2
SYMBOL pmos 5072 496 R0
WINDOW 123 56 100 Left 2
SYMATTR Value2 w=50n l=50n
SYMATTR InstName M46
SYMATTR Value PMOS2
SYMBOL diode 1456 352 R0
SYMATTR InstName D1
SYMATTR Value Didl
TEXT 1248 280 Left 2 ;C
TEXT 1216 -776 Left 2 ;D
TEXT -296 328 Left 2 !.tran 0 1ms 0 100ns
TEXT 1544 360 Left 2 ;Spike out
TEXT 72 448 Left 2 ;Post synaptic input
TEXT -1208 8 Left 2 !.include 32nm.model
TEXT 4048 296 Left 2 ;C
TEXT 4016 -760 Left 2 ;D
TEXT 4344 376 Left 2 ;Spike out
TEXT 2872 464 Left 2 ;Post synaptic input
TEXT -968 1224 Left 2 !.model Didl D(Ron=0.0001 Roff=100G Vfwd=0)
TEXT 6736 328 Left 2 ;C
TEXT 6704 -728 Left 2 ;D
TEXT 7032 408 Left 2 ;Spike out
TEXT 9728 392 Left 2 ;C
TEXT 9696 -664 Left 2 ;D
TEXT 10024 472 Left 2 ;Spike out
TEXT 8552 560 Left 2 ;Post synaptic input
TEXT 5416 448 Left 2 ;Post synaptic input

The netlist it stands for:
* multineuronarray2.asc
M1 N008 N025 0 0 NMOS2 w=2.3u l=1u
M2 N008 N008 N004 N004 PMOS2 w=2.3u l=1u
M3 N025 N008 N004 N004 PMOS2 w=2.3u l=1u
M4 N025 N014 0 0 NMOS2 w=1.3u l=22u
M5 N025 N016 N043 N043 NMOS2 w=5.3u l=1u
M6 N014 N014 0 0 NMOS2 w=1.3u l=18u
M7 N014 N008 N004 N004 PMOS2 w=1.3u l=14u
M8 N014 N011 N001 N001 PMOS2 w=1.3u l=1u
M9 N016 N011 N004 N004 PMOS2 w=1u l=3.8u
M10 N011 N011 N004 N004 PMOS2 w=1.8u l=1.3u
M11 N016 N028 N034 N034 NMOS2 w=1u l=4.3u
M12 N011 N025 N034 N034 NMOS2 w=2.8u l=1.3u
M13 N034 N040 0 0 NMOS2 w=2.3u l=3u
M14 N034 N034 0 0 NMOS2 w=2.3u l=3u
Cu N014 0 1p
Cv N025 0 0.1p
Vdd N004 0 3.3
Vth N028 0 1.7
Vbias N040 0 0.6
Vd N001 0 2
Vc N043 0 0.4
M15 N009 N026 0 0 NMOS2 w=2.3u l=1u
M16 N009 N009 N005 N005 PMOS2 w=2.3u l=1u
M17 N026 N009 N005 N005 PMOS2 w=2.3u l=1u
M18 N026 N017 0 0 NMOS2 w=1.3u l=22u
M19 N026 N018 N044 N044 NMOS2 w=5.3u l=1u
M20 N017 N017 0 0 NMOS2 w=1.3u l=18u
M21 N017 N009 N005 N005 PMOS2 w=1.3u l=14u
M22 N017 N012 N002 N002 PMOS2 w=1.3u l=1u
M23 N018 N012 N005 N005 PMOS2 w=1u l=3.8u
M24 N012 N012 N005 N005 PMOS2 w=1.8u l=1.3u
M25 N018 N030 N035 N035 NMOS2 w=1u l=4.3u
M26 N012 N029 N035 N035 NMOS2 w=2.8u l=1.3u
M27 N035 N041 0 0 NMOS2 w=2.3u l=3u
M28 N035 N035 0 0 NMOS2 w=2.3u l=3u
Cu1 N017 0 1p
Cv1 N026 0 0.1p
Vdd1 N005 0 3.3
Vth1 N030 0 1.7
Vbias1 N041 0 0.6
Vd1 N002 0 2
Vc1 N044 0 0.4
D3 N026 N029 Didl
G1 N052 N055 N052 NC_01 0.002
V1 N052 0 PULSE(0 0.05 10u 5u 5u 15u 300u 10)
D4 N053 N025 Didl
M30 N053 N057 N055 N055 PMOS2 w=2.3u l=1u
M29 N013 N027 0 0 NMOS2 w=2.3u l=1u
M31 N013 N013 N006 N006 PMOS2 w=2.3u l=1u
M32 N027 N013 N006 N006 PMOS2 w=2.3u l=1u
M33 N027 N020 0 0 NMOS2 w=1.3u l=22u
M34 N027 N021 N046 N046 NMOS2 w=5.3u l=1u
M35 N020 N020 0 0 NMOS2 w=1.3u l=18u
M36 N020 N013 N006 N006 PMOS2 w=1.3u l=14u
M37 N020 N015 N003 N003 PMOS2 w=1.3u l=1u
M38 N021 N015 N006 N006 PMOS2 w=1u l=3.8u
M39 N015 N015 N006 N006 PMOS2 w=1.8u l=1.3u
M40 N021 N033 N038 N038 NMOS2 w=1u l=4.3u
M41 N015 N032 N038 N038 NMOS2 w=2.8u l=1.3u
M42 N038 N042 0 0 NMOS2 w=2.3u l=3u
M43 N038 N038 0 0 NMOS2 w=2.3u l=3u
Cu2 N020 0 1p
Cv2 N027 0 0.1p
Vdd2 N006 0 3.3
Vth2 N033 0 1.7
Vbias2 N042 0 0.6
Vd2 N003 0 2
Vc2 N046 0 0.4
D7 N027 N032 Didl
D2 N029 N050 Didl
D6 N032 N051 Didl
M47 N019 N031 0 0 NMOS2 w=2.3u l=1u
M48 N019 N019 N010 N010 PMOS2 w=2.3u l=1u
M49 N031 N019 N010 N010 PMOS2 w=2.3u l=1u
M50 N031 N023 0 0 NMOS2 w=1.3u l=22u
M51 N031 N024 N047 N047 NMOS2 w=5.3u l=1u
M52 N023 N023 0 0 NMOS2 w=1.3u l=18u
M53 N023 N019 N010 N010 PMOS2 w=1.3u l=14u
M54 N023 N022 N007 N007 PMOS2 w=1.3u l=1u
M55 N024 N022 N010 N010 PMOS2 w=1u l=3.8u
M56 N022 N022 N010 N010 PMOS2 w=1.8u l=1.3u
M57 N024 N037 N039 N039 NMOS2 w=1u l=4.3u
M58 N022 N036 N039 N039 NMOS2 w=2.8u l=1.3u
M59 N039 N045 0 0 NMOS2 w=2.3u l=3u
M60 N039 N039 0 0 NMOS2 w=2.3u l=3u
Cu3 N023 0 1p
Cv3 N031 0 0.1p
Vdd3 N010 0 3.3
Vth4 N037 0 1.7
Vbias3 N045 0 0.6
Vd3 N007 0 2
Vc3 N047 0 0.4
D9 N031 N036 Didl
D10 N048 N031 MMSD4148
D11 N036 NC_02 Didl
M61 N048 N054 N033 N033 NMOS2 w=50n  l=25n
C4 N054 N051 0.1p
M44 N026 N058 N049 N049 PMOS2 w=50n l=50n
M46 N027 N056 N050 N050 PMOS2 w=50n l=50n
D1 N025 N049 Didl
.model D D
.lib standard.dio
.model NMOS NMOS
.model PMOS PMOS
.lib standard.mos
* C
* D
.tran 0 1ms 0 100ns
* Spike out
* Post synaptic input
.include 32nm.model
* C
* D
* Spike out
* Post synaptic input
.model Didl D(Ron=0.0001 Roff=100G Vfwd=0)
* C
* D
* Spike out
* C
* D
* Spike out
* Post synaptic input
* Post synaptic input
.backanno
.end